# EasyEDA Pro project OpenLightingController.epro

# Schematic Main Schematic
Board Name: Board1; Create Date: 2026-04-10; Page Name: P1; Project Name: OpenLightingController(mod); Schematic Name: Main Schematic; Update Date: 2026-04-15; Company: EasyEDA.com; Page Size: A4; Version: V1.0
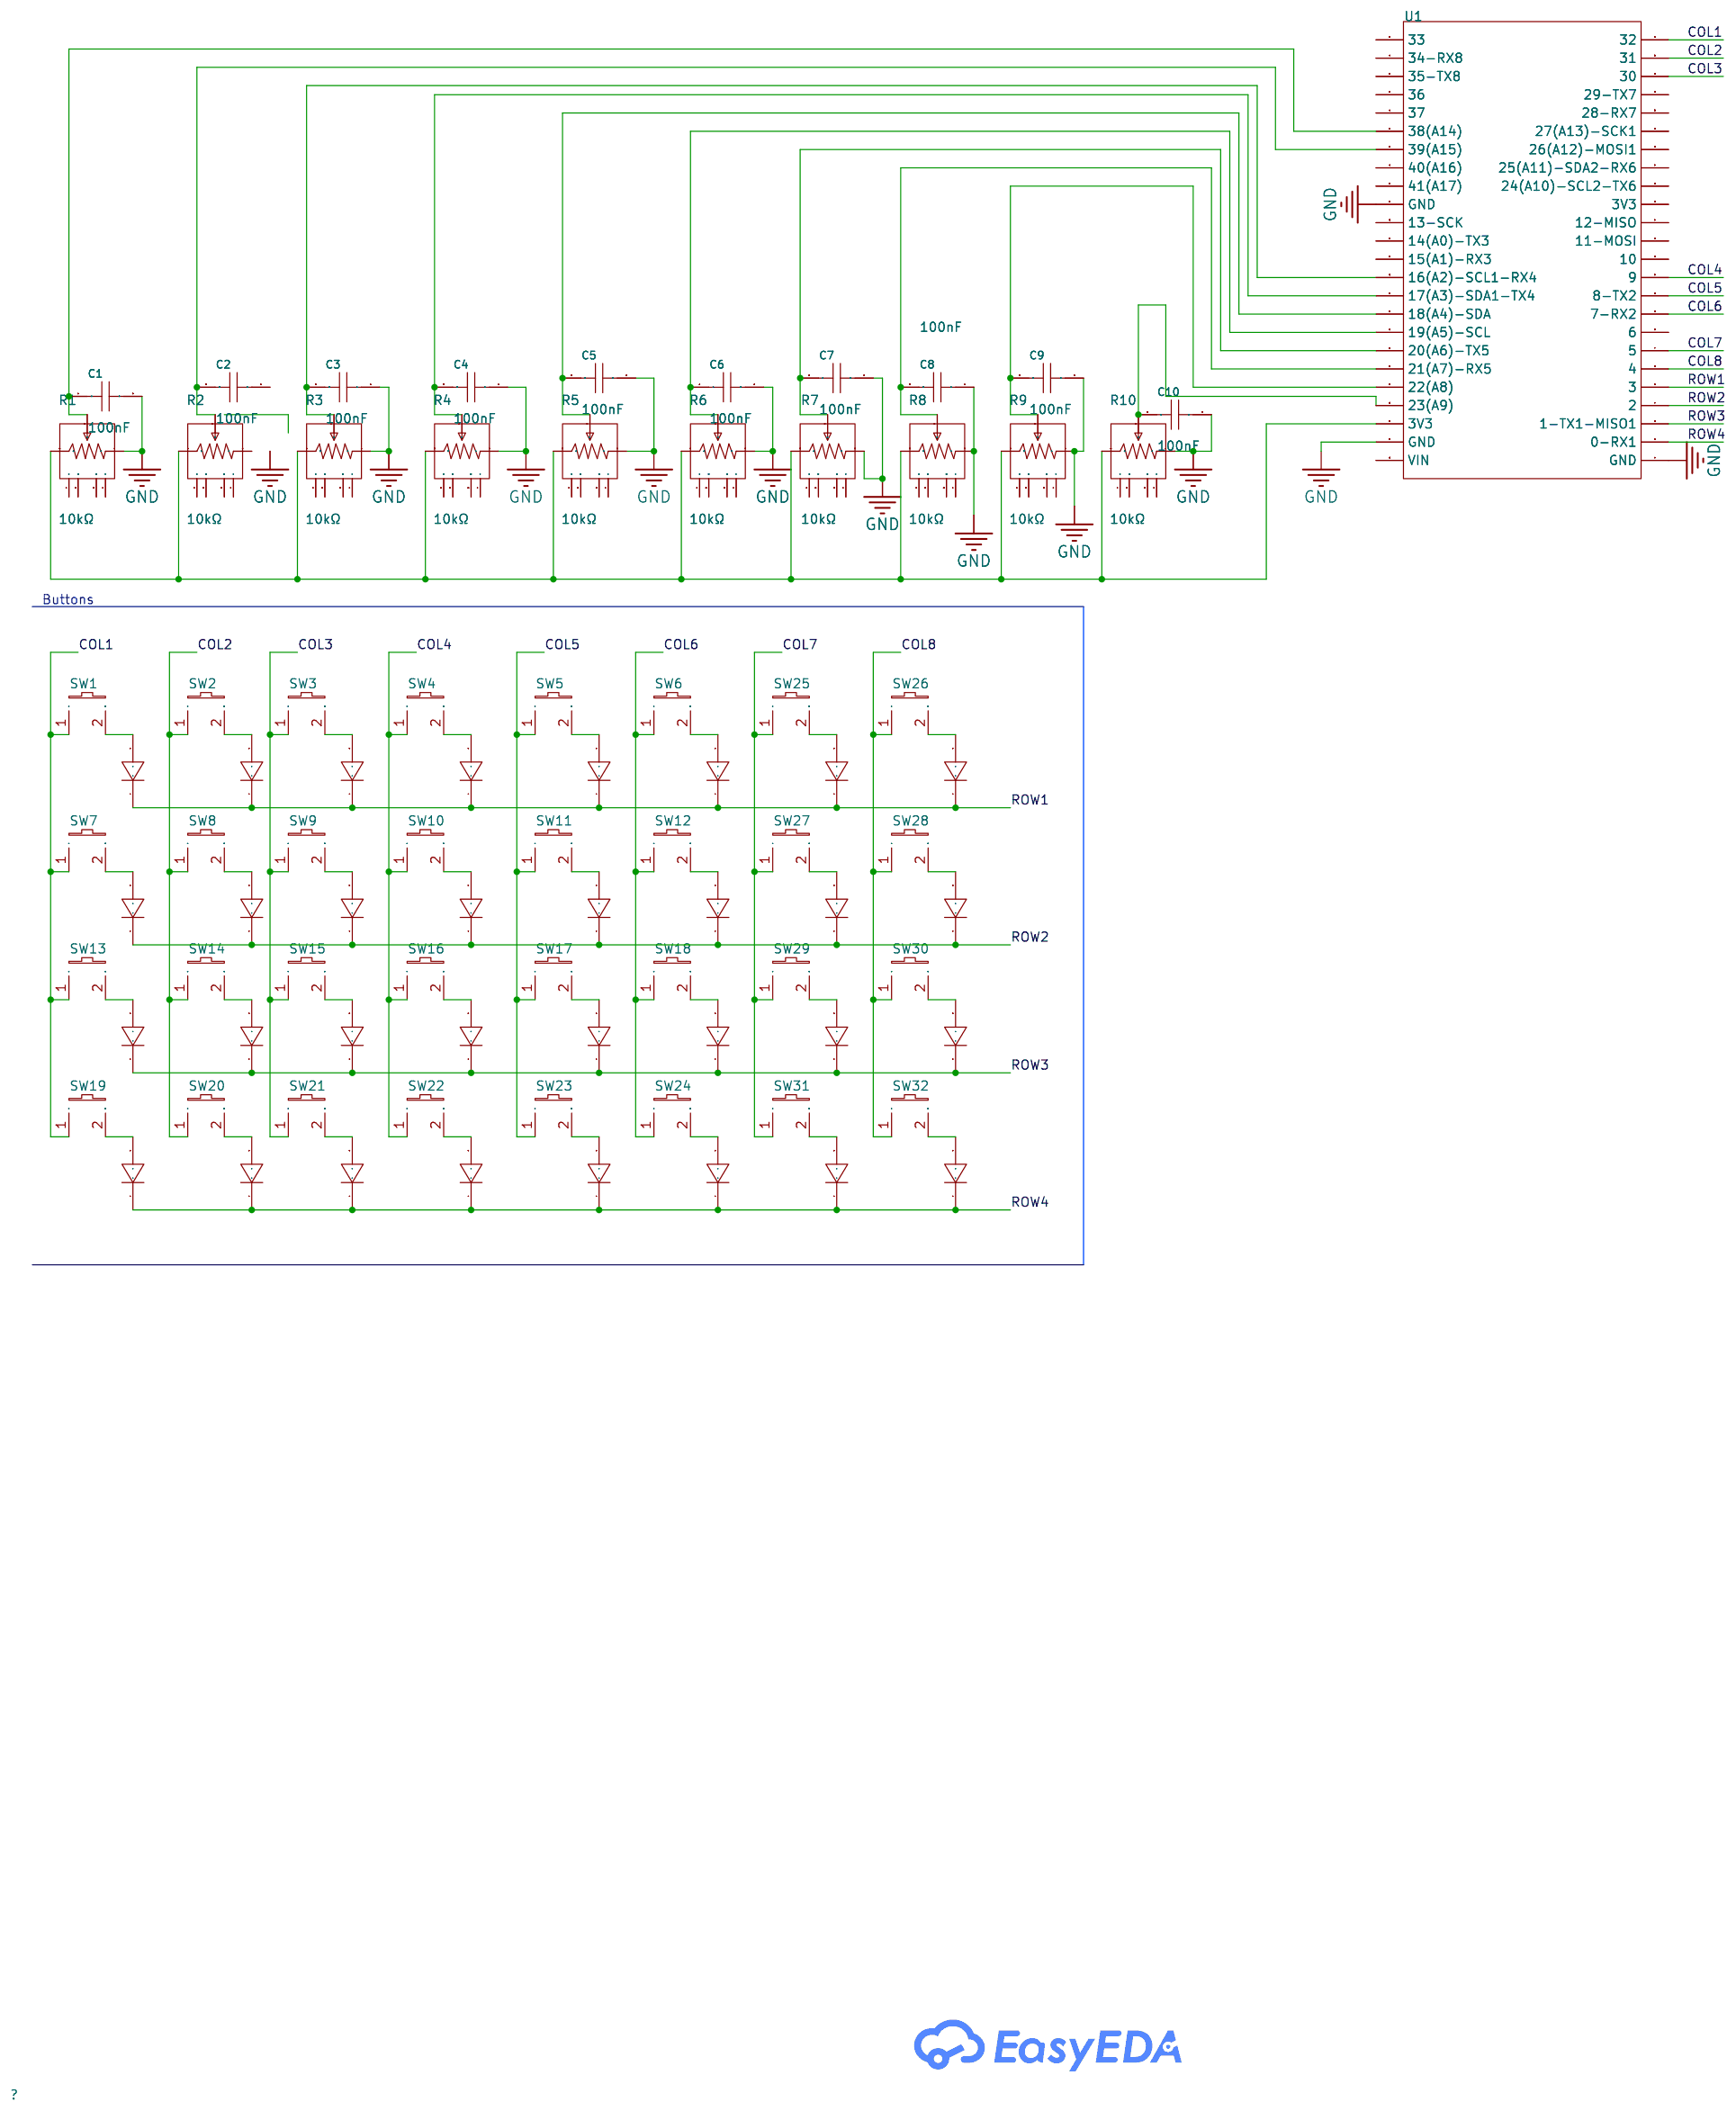
[diagram p0: schematic sheet]

## Parts
C1  100nF  [CAP-TH_L5.8-W2.4-P2.54-D0.6]
C2  100nF  [CAP-TH_L5.8-W2.4-P2.54-D0.6]
C3  100nF  [CAP-TH_L5.8-W2.4-P2.54-D0.6]
C4  100nF  [CAP-TH_L5.8-W2.4-P2.54-D0.6]
C5  100nF  [CAP-TH_L5.8-W2.4-P2.54-D0.6]
C6  100nF  [CAP-TH_L5.8-W2.4-P2.54-D0.6]
C7  100nF  [CAP-TH_L5.8-W2.4-P2.54-D0.6]
C8  100nF  [CAP-TH_L5.8-W2.4-P2.54-D0.6]
C9  100nF  [CAP-TH_L5.8-W2.4-P2.54-D0.6]
C10  100nF  [CAP-TH_L5.8-W2.4-P2.54-D0.6]
D1  1N4148  [DO-35_BD2.0-L4.0-P8.00-D0.5-FD]
D2  1N4148  [DO-35_BD2.0-L4.0-P8.00-D0.5-FD]
D3  1N4148  [DO-35_BD2.0-L4.0-P8.00-D0.5-FD]
D4  1N4148  [DO-35_BD2.0-L4.0-P8.00-D0.5-FD]
D5  1N4148  [DO-35_BD2.0-L4.0-P8.00-D0.5-FD]
D6  1N4148  [DO-35_BD2.0-L4.0-P8.00-D0.5-FD]
D7  1N4148  [DO-35_BD2.0-L4.0-P8.00-D0.5-FD]
D8  1N4148  [DO-35_BD2.0-L4.0-P8.00-D0.5-FD]
D9  1N4148  [DO-35_BD2.0-L4.0-P8.00-D0.5-FD]
D10  1N4148  [DO-35_BD2.0-L4.0-P8.00-D0.5-FD]
D11  1N4148  [DO-35_BD2.0-L4.0-P8.00-D0.5-FD]
D12  1N4148  [DO-35_BD2.0-L4.0-P8.00-D0.5-FD]
D13  1N4148  [DO-35_BD2.0-L4.0-P8.00-D0.5-FD]
D14  1N4148  [DO-35_BD2.0-L4.0-P8.00-D0.5-FD]
D15  1N4148  [DO-35_BD2.0-L4.0-P8.00-D0.5-FD]
D16  1N4148  [DO-35_BD2.0-L4.0-P8.00-D0.5-FD]
D17  1N4148  [DO-35_BD2.0-L4.0-P8.00-D0.5-FD]
D18  1N4148  [DO-35_BD2.0-L4.0-P8.00-D0.5-FD]
D19  1N4148  [DO-35_BD2.0-L4.0-P8.00-D0.5-FD]
D20  1N4148  [DO-35_BD2.0-L4.0-P8.00-D0.5-FD]
D21  1N4148  [DO-35_BD2.0-L4.0-P8.00-D0.5-FD]
D22  1N4148  [DO-35_BD2.0-L4.0-P8.00-D0.5-FD]
D23  1N4148  [DO-35_BD2.0-L4.0-P8.00-D0.5-FD]
D24  1N4148  [DO-35_BD2.0-L4.0-P8.00-D0.5-FD]
D25  1N4148  [DO-35_BD2.0-L4.0-P8.00-D0.5-FD]
D26  1N4148  [DO-35_BD2.0-L4.0-P8.00-D0.5-FD]
D27  1N4148  [DO-35_BD2.0-L4.0-P8.00-D0.5-FD]
D28  1N4148  [DO-35_BD2.0-L4.0-P8.00-D0.5-FD]
D29  1N4148  [DO-35_BD2.0-L4.0-P8.00-D0.5-FD]
D30  1N4148  [DO-35_BD2.0-L4.0-P8.00-D0.5-FD]
D31  1N4148  [DO-35_BD2.0-L4.0-P8.00-D0.5-FD]
D32  1N4148  [DO-35_BD2.0-L4.0-P8.00-D0.5-FD]
R1  10kΩ  [RES-ADJ-TH_PTA6043-2015DPB103]
R2  10kΩ  [RES-ADJ-TH_PTA6043-2015DPB103]
R3  10kΩ  [RES-ADJ-TH_PTA6043-2015DPB103]
R4  10kΩ  [RES-ADJ-TH_PTA6043-2015DPB103]
R5  10kΩ  [RES-ADJ-TH_PTA6043-2015DPB103]
R6  10kΩ  [RES-ADJ-TH_PTA6043-2015DPB103]
R7  10kΩ  [RES-ADJ-TH_PTA6043-2015DPB103]
R8  10kΩ  [RES-ADJ-TH_PTA6043-2015DPB103]
R9  10kΩ  [RES-ADJ-TH_PTA6043-2015DPB103]
R10  10kΩ  [RES-ADJ-TH_PTA6043-2015DPB103]
SW1  MX Switch  [SW-TH_MX1A-11NW]
SW2  MX Switch  [SW-TH_MX1A-11NW]
SW3  MX Switch  [SW-TH_MX1A-11NW]
SW4  MX Switch  [SW-TH_MX1A-11NW]
SW5  MX Switch  [SW-TH_MX1A-11NW]
SW6  MX Switch  [SW-TH_MX1A-11NW]
SW7  MX Switch  [SW-TH_MX1A-11NW]
SW8  MX Switch  [SW-TH_MX1A-11NW]
SW9  MX Switch  [SW-TH_MX1A-11NW]
SW10  MX Switch  [SW-TH_MX1A-11NW]
SW11  MX Switch  [SW-TH_MX1A-11NW]
SW12  MX Switch  [SW-TH_MX1A-11NW]
SW13  MX Switch  [SW-TH_MX1A-11NW]
SW14  MX Switch  [SW-TH_MX1A-11NW]
SW15  MX Switch  [SW-TH_MX1A-11NW]
SW16  MX Switch  [SW-TH_MX1A-11NW]
SW17  MX Switch  [SW-TH_MX1A-11NW]
SW18  MX Switch  [SW-TH_MX1A-11NW]
SW19  MX Switch  [SW-TH_MX1A-11NW]
SW20  MX Switch  [SW-TH_MX1A-11NW]
SW21  MX Switch  [SW-TH_MX1A-11NW]
SW22  MX Switch  [SW-TH_MX1A-11NW]
SW23  MX Switch  [SW-TH_MX1A-11NW]
SW24  MX Switch  [SW-TH_MX1A-11NW]
SW25  MX Switch  [SW-TH_MX1A-11NW]
SW26  MX Switch  [SW-TH_MX1A-11NW]
SW27  MX Switch  [SW-TH_MX1A-11NW]
SW28  MX Switch  [SW-TH_MX1A-11NW]
SW29  MX Switch  [SW-TH_MX1A-11NW]
SW30  MX Switch  [SW-TH_MX1A-11NW]
SW31  MX Switch  [SW-TH_MX1A-11NW]
SW32  MX Switch  [SW-TH_MX1A-11NW]
U1  -  [teensy 4.1]

## Library data of the parts
C1-C10 = CC1H104ZA1ED3F5P1100: Capacitance:100nF Tolerance:-20%~+80% Tolerance:-20%~+80% Voltage Rating:50V Pin Spacing:2.54mm Temperature Coefficient:Y5V Diameter:5.8mm Body Thickness:2.4mm; LCSC Part Name: 100nF -20%~+80% 50V; Supplier Part: C2832506; Manufacturer: Dersonic(德尔创); Supplier Footprint: 插件,P=2.54mm; JLCPCB Part Class: Extended Part; Datasheet: https://item.szlcsc.com/datasheet/CC1H104ZA1ED3F5P1100/2990644.html; Supplier: LCSC; Tolerance: -20%~+80%; Voltage Rating: 50V; Pin Spacing: 2.54mm; Temperature Coefficient: Y5V; Diameter: 5.8mm; Body Thickness: 2.4mm
D1-D32 = 1N4148_C258182: Diode Configuration:- Voltage - Forward(Vf@If):1V@10mA Voltage - DC Reverse(Vr):100V Current - Rectified:200mA Pd - Power Dissipation:500mW Reverse Leakage Current (Ir):5uA@75V Reverse Recovery Time (trr):4ns Operating Junction Temperature Range:-55℃~+175; LCSC Part Name: 100V 200mA; Supplier Part: C258182; Manufacturer: onsemi(安森美); Supplier Footprint: DO-35; JLCPCB Part Class: Extended Part; Datasheet: https://item.szlcsc.com/datasheet/1N4148/251208.html; Supplier: LCSC; Voltage - Forward(Vf@If): 1V@10mA; Voltage - DC Reverse(Vr): 100V; Current - Rectified: 200mA; Pd - Power Dissipation: 500mW; Reverse Leakage Current (Ir): 5uA@75V; Reverse Recovery Time (trr): 4ns; Operating Junction Temperature Range: -55℃~+175℃@(Tj); Non-Repetitive Peak Forward Surge Current: 4A
R1-R10 = PTA6043-2015CPB103: Resistance:10kΩ Tolerance:±20% Tolerance:±20% Voltage Rating:200V Power(Watts):250mW; LCSC Part Name: 10kΩ ±20%; Supplier Part: C17203852; Manufacturer: BOURNS; Supplier Footprint: 插件; JLCPCB Part Class: Extended Part; Datasheet: https://item.szlcsc.com/datasheet/PTA6043-2015CPB103/18332919.html; Supplier: LCSC; Tolerance: ±20%; Voltage Rating: 200V; Power(Watts): 250mW
SW1-SW32 = MX1A-11NW: Supplier Part: C3316924; Manufacturer: CHERRY; JLCPCB Part Class: Extended Part; Datasheet: https://item.szlcsc.com/datasheet/MX1A-11NW/3881518.html; Supplier: LCSC
U1 = teensy 4.1: _: 3

## Nets
GND: C1.2 C3.1 C4.1 C5.1 C6.2 C7.1 C8.1 C9.1 C10.1 R1.1 R3.1 R4.1 R5.1 R6.1 R7.1 R8.1 R9.1 R10.1 U1.1(GND) U1.26(GND) U1.39(GND)
COL1: SW1.1 SW7.1 SW13.1 SW19.1 U1.24(32)
COL2: SW2.1 SW8.1 SW14.1 SW20.1 U1.23(31)
COL3: SW3.1 SW9.1 SW15.1 SW21.1 U1.22(30)
COL4: SW4.1 SW10.1 SW16.1 SW22.1 U1.11(9)
COL5: SW5.1 SW11.1 SW17.1 SW23.1 U1.10(8-TX2)
COL6: SW6.1 SW12.1 SW18.1 SW24.1 U1.9(7-RX2)
COL7: SW25.1 SW27.1 SW29.1 SW31.1 U1.7(5)
COL8: SW26.1 SW28.1 SW30.1 SW32.1 U1.6(4)
ROW1: D1.1(K) D2.1(K) D3.1(K) D4.1(K) D5.1(K) D6.1(K) D25.1(K) D26.1(K) U1.5(3)
ROW2: D7.1(K) D8.1(K) D9.1(K) D10.1(K) D11.1(K) D12.1(K) D27.1(K) D28.1(K) U1.4(2)
ROW3: D13.1(K) D14.1(K) D15.1(K) D16.1(K) D17.1(K) D18.1(K) D29.1(K) D30.1(K) U1.3(1-TX1-MISO1)
ROW4: D19.1(K) D20.1(K) D21.1(K) D22.1(K) D23.1(K) D24.1(K) D31.1(K) D32.1(K) U1.2(0-RX1)
Net-(C1-1): C1.1 R1.2 U1.43(38(A14))
Net-(C2-2): C2.2 R2.2 U1.42(39(A15))
Net-(C3-2): C3.2 R3.2 U1.35(16(A2)-SCL1-RX4)
Net-(C4-2): C4.2 R4.2 U1.34(17(A3)-SDA1-TX4)
Net-(C5-2): C5.2 R5.2 U1.33(18(A4)-SDA)
Net-(C6-1): C6.1 R6.2 U1.32(19(A5)-SCL)
Net-(C7-2): C7.2 R7.2 U1.31(20(A6)-TX5)
Net-(C8-2): C8.2 R8.2 U1.30(21(A7)-RX5)
Net-(C9-2): C9.2 R9.2 U1.29(22(A8))
Net-(C10-2): C10.2 R10.2 U1.28(23(A9))
Net-(D1-2): D1.2(A) SW1.2
Net-(D2-2): D2.2(A) SW2.2
Net-(D3-2): D3.2(A) SW3.2
Net-(D4-2): D4.2(A) SW4.2
Net-(D5-2): D5.2(A) SW5.2
Net-(D6-2): D6.2(A) SW6.2
Net-(D7-2): D7.2(A) SW7.2
Net-(D8-2): D8.2(A) SW8.2
Net-(D9-2): D9.2(A) SW9.2
Net-(D10-2): D10.2(A) SW10.2
Net-(D11-2): D11.2(A) SW11.2
Net-(D12-2): D12.2(A) SW12.2
Net-(D13-2): D13.2(A) SW13.2
Net-(D14-2): D14.2(A) SW14.2
Net-(D15-2): D15.2(A) SW15.2
Net-(D16-2): D16.2(A) SW16.2
Net-(D17-2): D17.2(A) SW17.2
Net-(D18-2): D18.2(A) SW18.2
Net-(D19-2): D19.2(A) SW19.2
Net-(D20-2): D20.2(A) SW20.2
Net-(D21-2): D21.2(A) SW21.2
Net-(D22-2): D22.2(A) SW22.2
Net-(D23-2): D23.2(A) SW23.2
Net-(D24-2): D24.2(A) SW24.2
Net-(D25-2): D25.2(A) SW25.2
Net-(D26-2): D26.2(A) SW26.2
Net-(D27-2): D27.2(A) SW27.2
Net-(D28-2): D28.2(A) SW28.2
Net-(D29-2): D29.2(A) SW29.2
Net-(D30-2): D30.2(A) SW30.2
Net-(D31-2): D31.2(A) SW31.2
Net-(D32-2): D32.2(A) SW32.2
Net-(R1-3): R1.3 R2.3 R3.3 R4.3 R5.3 R6.3 R7.3 R8.3 R9.3 R10.3 U1.27(3V3)

Not connected (* = marked no-connect by the designer): C2 1; R1 4 5 6 7; R2 1 4 5 6 7; R3 4 5 6 7; R4 4 5 6 7; R5 4 5 6 7; R6 4 5 6 7; R7 4 5 6 7; R8 4 5 6 7; R9 4 5 6 7; R10 4 5 6 7; U1 8(6) 12(10) 13(11-MOSI) 14(12-MISO) 15(3V3) 16(24(A10)-SCL2-TX6) 17(25(A11)-SDA2-RX6) 18(26(A12)-MOSI1) 19(27(A13)-SCK1) 20(28-RX7) 21(29-TX7) 25(VIN) 36(15(A1)-RX3) 37(14(A0)-TX3) 38(13-SCK) 40(41(A17)) 41(40(A16)) 44(37) 45(36) 46(35-TX8) 47(34-RX8) 48(33)

## Notes on the sheet
- Buttons
